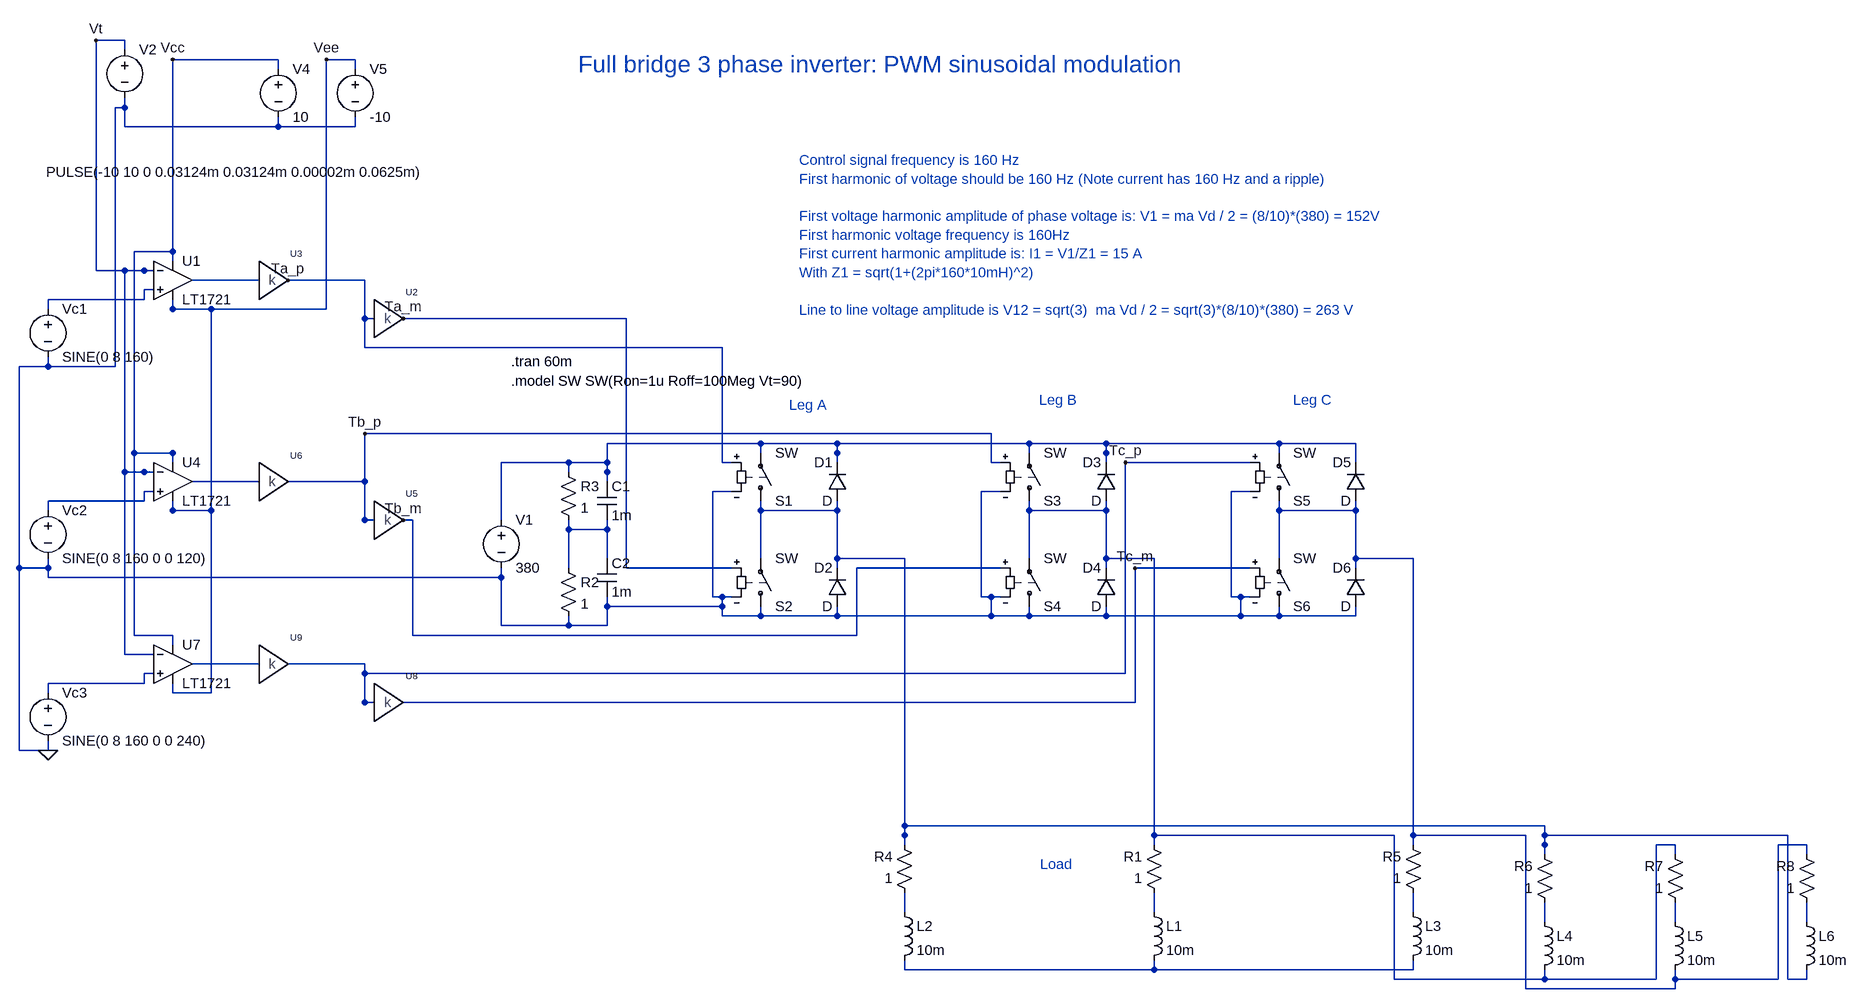
[diagram p0: schematic Three-phase-full-bridge-inverter.asc]
Three-phase-full-bridge-inverter.asc, the LTspice schematic file:
Version 4.1
SHEET 1 2456 1188
WIRE 176 320 176 336
WIRE 560 336 560 352
WIRE 1008 336 1008 352
WIRE 1424 336 1424 352
WIRE 112 352 112 368
WIRE 384 144 368 144
WIRE 432 336 432 352
WIRE 384 320 368 320
WIRE 832 144 816 144
WIRE 880 336 880 352
WIRE 832 320 816 320
WIRE 1248 144 1232 144
WIRE 1296 336 1296 352
WIRE 1248 320 1232 320
WIRE 0 272 0 288
WIRE -736 -512 -736 -496
WIRE -480 -480 -480 -464
WIRE -352 -480 -352 -464
WIRE -864 -80 -864 -64
WIRE -864 256 -864 272
WIRE -864 560 -864 576
WIRE 176 336 176 368
WIRE 176 368 112 368
WIRE 112 368 0 368
WIRE 0 368 0 288
WIRE 176 336 368 336
WIRE 368 336 368 320
WIRE 368 320 368 352
WIRE 368 352 432 352
WIRE 432 352 560 352
WIRE 368 320 352 320
WIRE 352 320 352 144
WIRE 352 144 368 144
WIRE 560 352 816 352
WIRE 816 352 816 320
WIRE 816 320 816 352
WIRE 816 352 880 352
WIRE 880 352 1008 352
WIRE 816 320 800 320
WIRE 800 320 800 144
WIRE 800 144 816 144
WIRE 1008 352 1232 352
WIRE 1232 352 1232 320
WIRE 1232 320 1232 352
WIRE 1232 352 1296 352
WIRE 1296 352 1424 352
WIRE 1232 320 1216 320
WIRE 1216 320 1216 144
WIRE 1216 144 1232 144
WIRE 0 288 -864 288
WIRE -864 288 -864 272
WIRE -864 272 -912 272
WIRE -912 272 -912 576
WIRE -912 576 -864 576
WIRE -912 272 -912 -64
WIRE -912 -64 -864 -64
WIRE -864 -64 -752 -64
WIRE -752 -64 -752 -496
WIRE -752 -496 -736 -496
WIRE -736 -496 -736 -464
WIRE -736 -464 -480 -464
WIRE -480 -464 -352 -464
FLAG -864 576 0
WIRE -624 -208 -608 -208
WIRE -512 -208 -528 -208
WIRE -608 -208 -528 -208
WIRE -688 -192 -704 -192
WIRE -864 -160 -864 -176
WIRE -704 -192 -704 -176
WIRE -704 -176 -864 -176
WIRE 176 128 176 112
WIRE 560 96 560 80
WIRE 1008 96 1008 80
WIRE 1424 96 1424 80
WIRE 112 112 112 96
WIRE 432 80 432 64
WIRE 880 80 880 64
WIRE 1296 80 1296 64
WIRE 0 192 0 176
WIRE 176 112 176 96
WIRE 176 96 112 96
WIRE 112 96 0 96
WIRE 0 96 0 176
WIRE 176 112 176 64
WIRE 176 64 432 64
WIRE 432 64 560 64
WIRE 560 64 560 80
WIRE 560 80 560 64
WIRE 560 64 880 64
WIRE 880 64 1008 64
WIRE 1008 64 1008 80
WIRE 1008 80 1008 64
WIRE 1008 64 1296 64
WIRE 1296 64 1424 64
WIRE 1424 64 1424 80
WIRE -624 128 -608 128
WIRE -512 128 -528 128
WIRE -608 128 -528 128
WIRE -688 144 -704 144
WIRE -864 176 -864 160
WIRE -704 144 -704 160
WIRE -704 160 -864 160
WIRE 176 192 176 208
WIRE 176 256 176 240
WIRE 112 272 112 256
WIRE 112 192 112 208
WIRE 176 208 176 240
WIRE 176 208 112 208
WIRE 112 208 112 256
WIRE 560 160 560 176
WIRE 560 272 560 256
WIRE 2384 1040 2384 1056
WIRE 672 832 672 816
WIRE 1904 848 1904 832
WIRE 432 160 432 176
WIRE 432 256 432 240
WIRE 560 176 560 256
WIRE 560 176 432 176
WIRE 432 176 432 240
WIRE 560 256 672 256
WIRE 672 256 672 816
WIRE 672 816 672 800
WIRE 672 800 1904 800
WIRE 1904 800 1904 832
WIRE 1904 832 1904 816
WIRE 1904 816 2352 816
WIRE 2352 816 2352 1056
WIRE 2352 1056 2384 1056
WIRE 1008 160 1008 176
WIRE 1008 272 1008 256
WIRE 1904 1040 1904 1056
WIRE 1088 832 1088 816
WIRE 2160 848 2160 832
WIRE 880 160 880 176
WIRE 880 256 880 240
WIRE 1008 176 1008 256
WIRE 1008 176 880 176
WIRE 880 176 880 240
WIRE 1008 256 1088 256
WIRE 1088 256 1088 816
WIRE 1088 816 1488 816
WIRE 1488 816 1488 1056
WIRE 1488 1056 1904 1056
WIRE 1904 1056 2128 1056
WIRE 2128 1056 2128 832
WIRE 2128 832 2160 832
WIRE 1424 160 1424 176
WIRE 1424 272 1424 256
WIRE 2160 1040 2160 1056
WIRE 1520 832 1520 816
WIRE 2384 848 2384 832
WIRE 1296 160 1296 176
WIRE 1296 256 1296 240
WIRE 1424 176 1424 256
WIRE 1424 176 1296 176
WIRE 1296 176 1296 240
WIRE 1424 256 1520 256
WIRE 1520 256 1520 816
WIRE 1520 816 1872 816
WIRE 1872 816 1872 1072
WIRE 1872 1072 2160 1072
WIRE 2160 1072 2160 1056
WIRE 2160 1056 2336 1056
WIRE 2336 1056 2336 832
WIRE 2336 832 2384 832
WIRE -624 432 -608 432
WIRE -512 432 -528 432
WIRE -608 432 -528 432
WIRE -688 448 -704 448
WIRE -864 480 -864 464
WIRE -704 448 -704 464
WIRE -704 464 -864 464
WIRE 672 944 672 928
WIRE 672 912 672 928
WIRE 1088 944 1088 928
WIRE 1088 912 1088 928
WIRE 1520 944 1520 928
WIRE 1520 912 1520 928
WIRE 1904 960 1904 944
WIRE 1904 928 1904 944
WIRE 2160 960 2160 944
WIRE 2160 928 2160 944
WIRE 2384 960 2384 944
WIRE 2384 928 2384 944
WIRE 1088 1024 1088 1040
WIRE 672 1024 672 1040
WIRE 1520 1024 1520 1040
WIRE 1088 1040 672 1040
WIRE 1088 1040 1520 1040
WIRE 384 272 368 272
WIRE -272 -144 -256 -144
WIRE 368 272 208 272
WIRE 208 272 208 -144
WIRE 208 -144 -256 -144
FLAG -272 -144 Ta_m
WIRE 384 96 368 96
WIRE -320 -144 -336 -144
WIRE -464 -208 -448 -208
WIRE 368 96 368 -96
WIRE 368 -96 -336 -96
WIRE -336 -96 -336 -144
WIRE -336 -144 -336 -208
WIRE -336 -208 -448 -208
FLAG -464 -208 Ta_p
WIRE 832 272 816 272
WIRE -272 192 -256 192
WIRE 816 272 592 272
WIRE 592 272 592 384
WIRE 592 384 -256 384
WIRE -256 384 -256 192
FLAG -272 192 Tb_m
WIRE 832 96 816 96
WIRE -320 192 -336 192
WIRE -464 128 -448 128
WIRE 816 96 816 48
WIRE 816 48 -336 48
WIRE -336 48 -336 192
WIRE -336 192 -336 128
WIRE -336 128 -448 128
FLAG -336 48 Tb_p
WIRE 1248 272 1232 272
WIRE -272 496 -256 496
WIRE 1232 272 1056 272
WIRE 1056 272 1056 496
WIRE 1056 496 -256 496
FLAG 1056 272 Tc_m
WIRE 1248 96 1232 96
WIRE -320 496 -336 496
WIRE -464 432 -448 432
WIRE 1232 96 1040 96
WIRE 1040 96 1040 448
WIRE 1040 448 -336 448
WIRE -336 448 -336 496
WIRE -336 496 -336 432
WIRE -336 432 -448 432
FLAG 1040 96 Tc_p
WIRE -656 -240 -656 -256
WIRE -656 96 -656 80
WIRE -656 400 -656 384
WIRE -480 -560 -480 -576
WIRE -656 -256 -720 -256
WIRE -720 -256 -720 80
WIRE -720 80 -656 80
WIRE -656 80 -720 80
WIRE -720 80 -720 384
WIRE -720 384 -656 384
WIRE -656 -256 -656 -576
WIRE -656 -576 -480 -576
FLAG -656 -576 Vcc
WIRE -656 -176 -656 -160
WIRE -656 160 -656 176
WIRE -656 464 -656 480
WIRE -352 -560 -352 -576
WIRE -656 -160 -592 -160
WIRE -592 -160 -592 176
WIRE -592 176 -656 176
WIRE -656 176 -592 176
WIRE -592 176 -592 480
WIRE -592 480 -656 480
WIRE -656 -160 -400 -160
WIRE -400 -160 -400 -576
WIRE -400 -576 -352 -576
FLAG -400 -576 Vee
WIRE -688 -224 -704 -224
WIRE -688 112 -704 112
WIRE -688 416 -704 416
WIRE -736 -592 -736 -608
WIRE -704 -224 -736 -224
WIRE -736 -224 -736 112
WIRE -736 112 -704 112
WIRE -704 112 -736 112
WIRE -736 112 -736 416
WIRE -736 416 -704 416
WIRE -704 -224 -784 -224
WIRE -784 -224 -784 -608
WIRE -784 -608 -736 -608
FLAG -784 -608 Vt
SYMBOL voltage 0 176 R0
WINDOW 123 0 0 Left 0
WINDOW 39 0 0 Left 0
SYMATTR InstName V1
SYMATTR Value 380
SYMBOL cap 160 128 R0
SYMATTR InstName C1
SYMATTR Value 1m
SYMATTR SpiceLine Rser=1m Rpar=1Meg
SYMBOL cap 160 256 R0
SYMATTR InstName C2
SYMATTR Value 1m
SYMATTR SpiceLine Rser=1m Rpar=1Meg
SYMBOL res 1104 928 R180
WINDOW 0 36 76 Left 2
WINDOW 3 36 40 Left 2
SYMATTR InstName R1
SYMATTR Value 1
SYMBOL ind 1072 928 R0
SYMATTR InstName L1
SYMATTR Value 10m
SYMBOL sw 432 176 M180
SYMATTR InstName S1
SYMBOL diode 576 160 R180
WINDOW 0 24 64 Left 2
WINDOW 3 24 0 Left 2
SYMATTR InstName D1
SYMBOL sw 432 352 M180
SYMATTR InstName S2
SYMBOL diode 576 336 R180
WINDOW 0 24 64 Left 2
WINDOW 3 24 0 Left 2
SYMATTR InstName D2
SYMBOL voltage -864 -176 R0
WINDOW 123 0 0 Left 0
WINDOW 39 0 0 Left 0
SYMATTR InstName Vc1
SYMATTR Value SINE(0 8 160)
SYMBOL Comparators\\LT1721 -656 -272 R0
SYMATTR InstName U1
SYMBOL voltage -480 -576 R0
WINDOW 123 0 0 Left 0
WINDOW 39 0 0 Left 0
SYMATTR InstName V4
SYMATTR Value 10
SYMBOL voltage -352 -576 R0
WINDOW 123 0 0 Left 0
WINDOW 39 0 0 Left 0
SYMATTR InstName V5
SYMATTR Value -10
SYMBOL Gain -304 -144 R0
SYMATTR InstName U2
SYMBOL voltage -736 -608 R0
WINDOW 3 -131 220 Left 2
WINDOW 123 0 0 Left 0
WINDOW 39 0 0 Left 0
SYMATTR Value PULSE(-10 10 0 0.03124m 0.03124m 0.00002m 0.0625m)
SYMATTR InstName V2
SYMBOL Gain -496 -208 R0
SYMATTR SpiceLine G=100
SYMATTR InstName U3
SYMBOL res 96 256 R0
SYMATTR InstName R2
SYMATTR Value 1
SYMBOL res 96 96 R0
SYMATTR InstName R3
SYMATTR Value 1
SYMBOL sw 880 176 M180
SYMATTR InstName S3
SYMBOL diode 1024 160 R180
WINDOW 0 24 64 Left 2
WINDOW 3 24 0 Left 2
SYMATTR InstName D3
SYMBOL sw 880 352 M180
SYMATTR InstName S4
SYMBOL diode 1024 336 R180
WINDOW 0 24 64 Left 2
WINDOW 3 24 0 Left 2
SYMATTR InstName D4
SYMBOL sw 1296 176 M180
SYMATTR InstName S5
SYMBOL diode 1440 160 R180
WINDOW 0 24 64 Left 2
WINDOW 3 24 0 Left 2
SYMATTR InstName D5
SYMBOL sw 1296 352 M180
SYMATTR InstName S6
SYMBOL diode 1440 336 R180
WINDOW 0 24 64 Left 2
WINDOW 3 24 0 Left 2
SYMATTR InstName D6
SYMBOL voltage -864 160 R0
WINDOW 123 0 0 Left 0
WINDOW 39 0 0 Left 0
SYMATTR InstName Vc2
SYMATTR Value SINE(0 8 160 0 0 120)
SYMBOL Comparators\\LT1721 -656 64 R0
SYMATTR InstName U4
SYMBOL Gain -304 192 R0
SYMATTR InstName U5
SYMBOL Gain -496 128 R0
SYMATTR SpiceLine G=100
SYMATTR InstName U6
SYMBOL voltage -864 464 R0
WINDOW 123 0 0 Left 0
WINDOW 39 0 0 Left 0
SYMATTR InstName Vc3
SYMATTR Value SINE(0 8 160 0 0 240)
SYMBOL Comparators\\LT1721 -656 368 R0
SYMATTR InstName U7
SYMBOL Gain -304 496 R0
SYMATTR InstName U8
SYMBOL Gain -496 432 R0
SYMATTR SpiceLine G=100
SYMATTR InstName U9
SYMBOL res 688 928 R180
WINDOW 0 36 76 Left 2
WINDOW 3 36 40 Left 2
SYMATTR InstName R4
SYMATTR Value 1
SYMBOL ind 656 928 R0
SYMATTR InstName L2
SYMATTR Value 10m
SYMBOL res 1536 928 R180
WINDOW 0 36 76 Left 2
WINDOW 3 36 40 Left 2
SYMATTR InstName R5
SYMATTR Value 1
SYMBOL ind 1504 928 R0
SYMATTR InstName L3
SYMATTR Value 10m
SYMBOL res 1920 944 R180
WINDOW 0 36 76 Left 2
WINDOW 3 36 40 Left 2
SYMATTR InstName R6
SYMATTR Value 1
SYMBOL ind 1888 944 R0
SYMATTR InstName L4
SYMATTR Value 10m
SYMBOL res 2176 944 R180
WINDOW 0 36 76 Left 2
WINDOW 3 36 40 Left 2
SYMATTR InstName R7
SYMATTR Value 1
SYMBOL ind 2144 944 R0
SYMATTR InstName L5
SYMATTR Value 10m
SYMBOL res 2400 944 R180
WINDOW 0 36 76 Left 2
WINDOW 3 36 40 Left 2
SYMATTR InstName R8
SYMATTR Value 1
SYMBOL ind 2368 944 R0
SYMATTR InstName L6
SYMATTR Value 10m
TEXT 16 -40 Left 2 !.model SW SW(Ron=1u Roff=100Meg Vt=90)
TEXT 16 -72 Left 2 !.tran 60m
TEXT 496 -408 Left 2 ;Control signal frequency is 160 Hz\nFirst harmonic of voltage should be 160 Hz (Note current has 160 Hz and a ripple)\n \nFirst voltage harmonic amplitude of phase voltage is: V1 = ma Vd / 2 = (8/10)*(380) = 152V\nFirst harmonic voltage frequency is 160Hz\nFirst current harmonic amplitude is: I1 = V1/Z1 = 15 A\nWith Z1 = sqrt(1+(2pi*160*10mH)^2)\n \nLine to line voltage amplitude is V12 = sqrt(3)  ma Vd / 2 = sqrt(3)*(8/10)*(380) = 263 V
TEXT 952 864 Right 2 ;Load
TEXT 480 0 Left 2 ;Leg A
TEXT 896 -8 Left 2 ;Leg B
TEXT 1320 -8 Left 2 ;Leg C
TEXT 128 -568 Left 4 ;Full bridge 3 phase inverter: PWM sinusoidal modulation

The netlist it stands for:
* Three-phase-full-bridge-inverter.asc
V1 N003 0 380
C1 N003 N006 1m Rser=1m Rpar=1Meg
C2 N006 0 1m Rser=1m Rpar=1Meg
R1 N013 N008 1
L1 N013 N018 10m
S1 N007 N003 Ta_p 0 SW
D1 N007 N003 D
S2 0 N007 Ta_m 0 SW
D2 0 N007 D
Vc1 N002 0 SINE(0 8 160)
X§U1 N002 Vt Vcc Vee N001 LT1720  ; LT1721, pins In+ In- V+ V- OUT
V4 Vcc 0 10
V5 Vee 0 -10
E§U2 Ta_p Ta_m G={G}
V2 Vt 0 PULSE(-10 10 0 0.03124m 0.03124m 0.00002m 0.0625m)
E§U3 N001 Ta_p G={G} G=100
R2 N006 0 1
R3 N003 N006 1
S3 N008 N003 Tb_p 0 SW
D3 N008 N003 D
S4 0 N008 Tb_m 0 SW
D4 0 N008 D
S5 N009 N003 Tc_p 0 SW
D5 N009 N003 D
S6 0 N009 Tc_m 0 SW
D6 0 N009 D
Vc2 N005 0 SINE(0 8 160 0 0 120)
X§U4 N005 Vt Vcc Vee N004 LT1720  ; LT1721, pins In+ In- V+ V- OUT
E§U5 Tb_p Tb_m G={G}
E§U6 N004 Tb_p G={G} G=100
Vc3 N011 0 SINE(0 8 160 0 0 240)
X§U7 N011 Vt Vcc Vee N010 LT1720  ; LT1721, pins In+ In- V+ V- OUT
E§U8 Tc_p Tc_m G={G}
E§U9 N010 Tc_p G={G} G=100
R4 N012 N007 1
L2 N012 N018 10m
R5 N014 N009 1
L3 N014 N018 10m
R6 N015 N007 1
L4 N015 N008 10m
R7 N016 N008 1
L5 N016 N009 10m
R8 N017 N009 1
L6 N017 N007 10m
.model D D
.lib standard.dio
.model SW SW(Ron=1u Roff=100Meg Vt=90)
.tran 60m
* Control signal frequency is 160 Hz
* First harmonic of voltage should be 160 Hz (Note current has 160 Hz and a ripple)
* First voltage harmonic amplitude of phase voltage is: V1 = ma Vd / 2 = (8/10)*(380) = 152V
* First harmonic voltage frequency is 160Hz
* First current harmonic amplitude is: I1 = V1/Z1 = 15 A
* With Z1 = sqrt(1+(2pi*160*10mH)^2)
* Line to line voltage amplitude is V12 = sqrt(3)  ma Vd / 2 = sqrt(3)*(8/10)*(380) = 263 V
* Load
* Leg A
* Leg B
* Leg C
* Full bridge 3 phase inverter: PWM sinusoidal modulation
.lib LTC.lib
.backanno
.end